# EAGLE design switch (EAGLE 4.16)
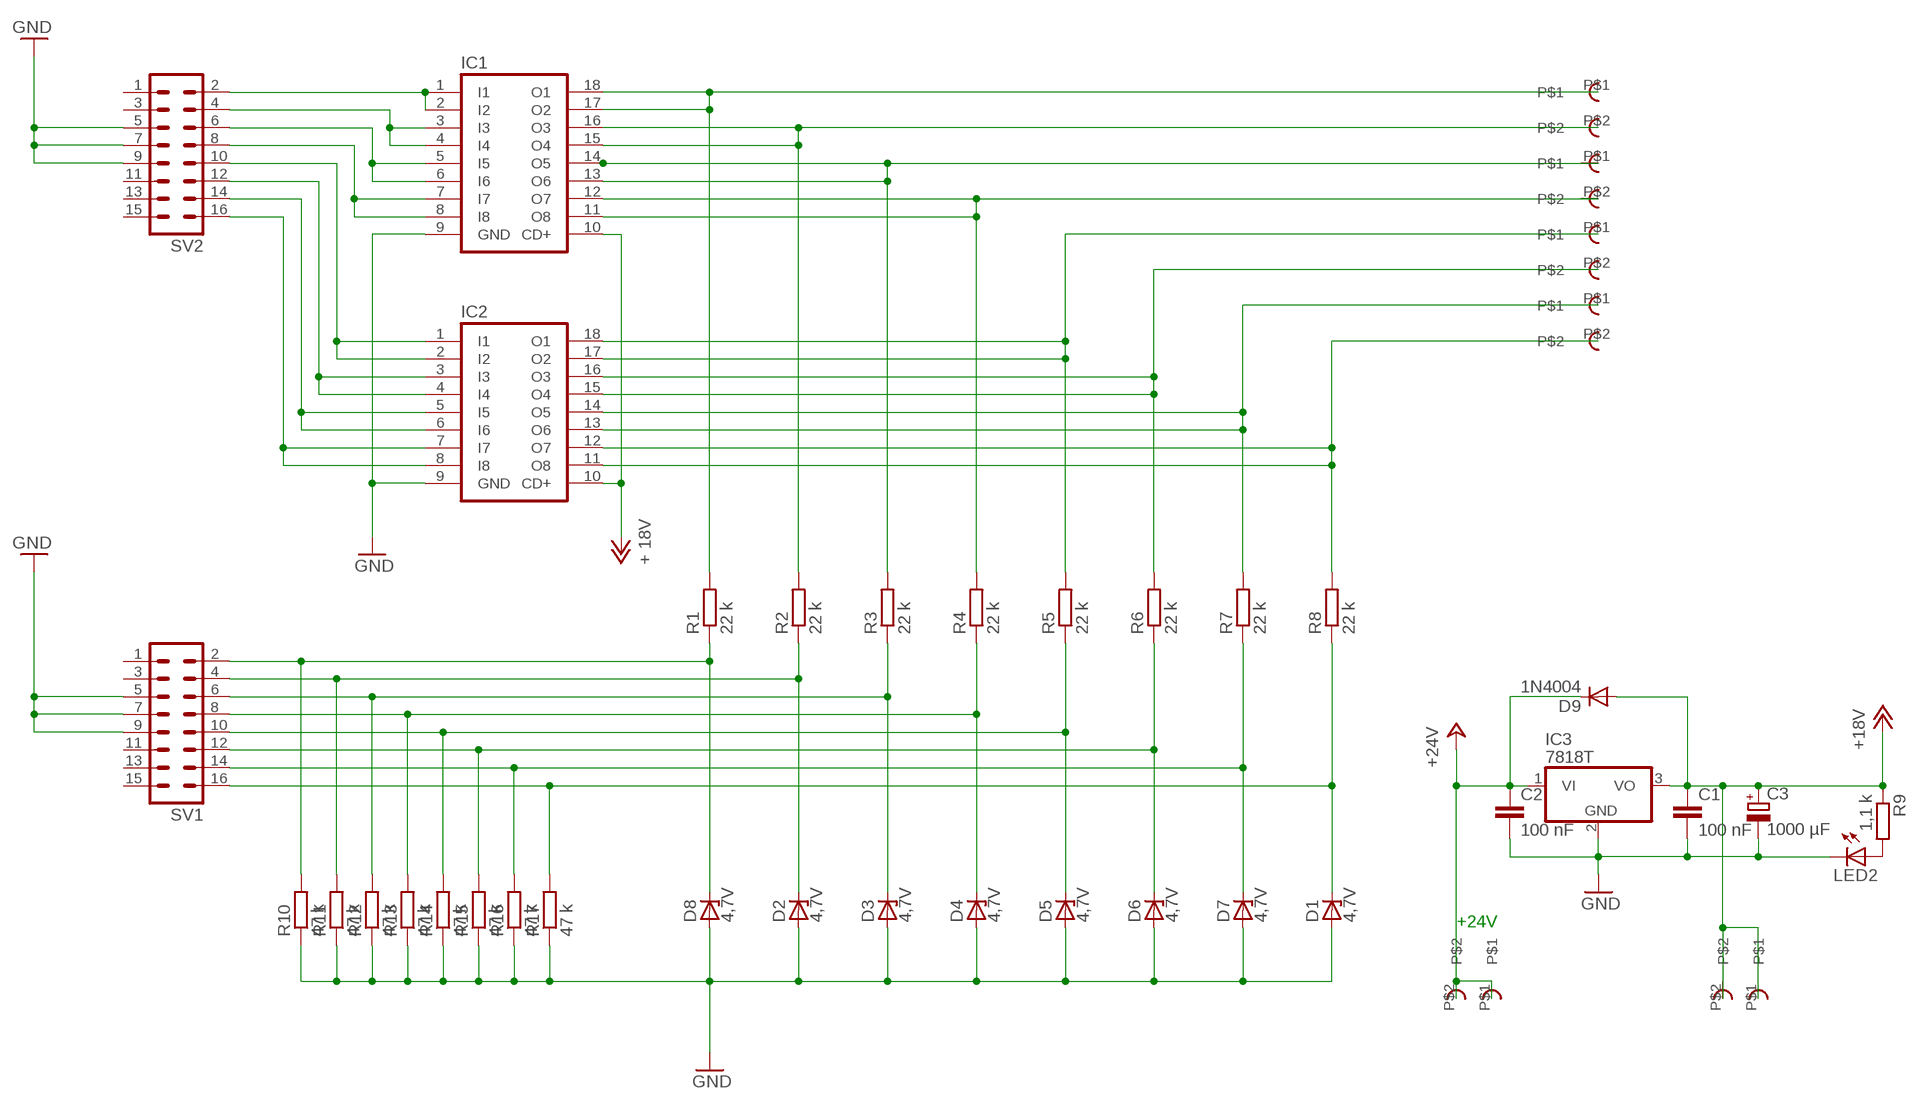
[diagram p0: schematic, sheet 1]

## Parts
+18V  RIACON101-2  [RIACON101-2]
+24V  RIACON101-2  [RIACON101-2]
C1  100 nF  C-EUC0603K  [C0603K]
C2  100 nF  C-EUC0603K  [C0603K]
C3  1000 µF  CPOL-EUE5-10.5  [E5-10,5]
D1  4,7V  ZENER-DIODESOD80C  [SOD80C]
D2  4,7V  ZENER-DIODESOD80C  [SOD80C]
D3  4,7V  ZENER-DIODESOD80C  [SOD80C]
D4  4,7V  ZENER-DIODESOD80C  [SOD80C]
D5  4,7V  ZENER-DIODESOD80C  [SOD80C]
D6  4,7V  ZENER-DIODESOD80C  [SOD80C]
D7  4,7V  ZENER-DIODESOD80C  [SOD80C]
D8  4,7V  ZENER-DIODESOD80C  [SOD80C]
D9  1N4004  [DO41-10]
IC1  ULN2803A  [DIL18]
IC2  ULN2803A  [DIL18]
IC3  7818T  [TO220H]
LED2  LEDCHIPLED_0603  [CHIPLED_0603]
R1  22 k  R-EU_R0603  [R0603]
R2  22 k  R-EU_R0603  [R0603]
R3  22 k  R-EU_R0603  [R0603]
R4  22 k  R-EU_R0603  [R0603]
R5  22 k  R-EU_R0603  [R0603]
R6  22 k  R-EU_R0603  [R0603]
R7  22 k  R-EU_R0603  [R0603]
R8  22 k  R-EU_R0603  [R0603]
R9  1,1 k  R-EU_R0603  [R0603]
R10  47 k  R-EU_R0603  [R0603]
R11  47 k  R-EU_R0603  [R0603]
R12  47 k  R-EU_R0603  [R0603]
R13  47 k  R-EU_R0603  [R0603]
R14  47 k  R-EU_R0603  [R0603]
R15  47 k  R-EU_R0603  [R0603]
R16  47 k  R-EU_R0603  [R0603]
R17  47 k  R-EU_R0603  [R0603]
SV1  ML16  [ML16]
SV2  ML16  [ML16]
U$1  RIACON101-2  [RIACON101-2]
U$2  RIACON101-2  [RIACON101-2]
U$3  RIACON101-2  [RIACON101-2]
U$4  RIACON101-2  [RIACON101-2]

## Nets
+18V: +18V.P$1 +18V.P$2 C1.1 C3.+ D9.A IC1.10(CD+) IC2.10(CD+) IC3.3(VO) R9.1 ; supply symbol labelled + 18V
+24V: +24V.P$1 +24V.P$2 C2.1 D9.C IC3.1(VI)
GND: C1.2 C2.2 C3.- D1.A D2.A D3.A D4.A D5.A D6.A D7.A D8.A IC1.9(GND) IC2.9(GND) IC3.2(GND) LED2.C R10.1 R11.1 R12.1 R13.1 R14.1 R15.1 R16.1 R17.1 SV1.5 SV1.7 SV1.9 SV2.5 SV2.7 SV2.9
N$1: IC1.1(I1) IC1.2(I2) SV2.2
N$2: IC1.3(I3) IC1.4(I4) SV2.4
N$3: IC1.5(I5) IC1.6(I6) SV2.6
N$4: IC1.7(I7) IC1.8(I8) SV2.8
N$5: IC2.1(I1) IC2.2(I2) SV2.10
N$6: IC1.13(O6) IC1.14(O5) R3.2 U$2.P$1
N$7: IC2.3(I3) IC2.4(I4) SV2.12
N$8: IC2.5(I5) IC2.6(I6) SV2.14
N$9: IC2.7(I7) IC2.8(I8) SV2.16
N$10: IC1.15(O4) IC1.16(O3) R2.2 U$1.P$2
N$11: IC1.11(O8) IC1.12(O7) R4.2 U$2.P$2
N$12: IC1.17(O2) IC1.18(O1) R1.2 U$1.P$1
N$13: IC2.17(O2) IC2.18(O1) R5.2 U$3.P$1
N$14: IC2.15(O4) IC2.16(O3) R6.2 U$3.P$2
N$15: IC2.13(O6) IC2.14(O5) R7.2 U$4.P$1
N$16: LED2.A R9.2
N$17: IC2.11(O8) IC2.12(O7) R8.2 U$4.P$2
N$18: D8.C R1.1 R10.2 SV1.2
N$19: D2.C R2.1 R11.2 SV1.4
N$20: D3.C R3.1 R12.2 SV1.6
N$21: D4.C R4.1 R13.2 SV1.8
N$22: D5.C R5.1 R14.2 SV1.10
N$23: D6.C R6.1 R15.2 SV1.12
N$24: D7.C R7.1 R16.2 SV1.14
N$25: D1.C R8.1 R17.2 SV1.16
Unconnected: SV1.1 SV1.3 SV1.11 SV1.13 SV1.15 SV2.1 SV2.3 SV2.11 SV2.13 SV2.15

## Notes on the sheet
- +24V

## Library data of the parts
+18V +24V U$1-U$4 = con-riacon101:RIACON101-2: Riaconn Schreaubklemme 101
C1 C2 = rcl:C-EU: CAPACITOR, European symbol
C3 = rcl:CPOL-EU: POLARIZED CAPACITOR, European symbol
D1-D8 = diode:ZENER-DIODE: Z-Diode
D9 = diode:1N4004: DIODE general purpose rectifier, 1 A
IC1 IC2 = uln-udn:ULN2803A: DRIVER ARRAY
IC3 = linear:78*: Positive VOLTAGE REGULATOR Source: http://cache.national.com/ds/LM/LM78L05.pdf http://www.fairchildsemi.com/ds/LM/LM7805.pdf
LED2 = led:LED: LED OSRAM: - CHIPLED LG R971, LG N971, LY N971, LG Q971, LY Q971, LO R971, LY R971 LH N974, LH R974 LS Q976, LO Q976, LY Q976 LO Q996 - Hyper CHIPLED LW Q18S LB Q993, LB Q99A, LB R99A - SideLED LS A670, LO A670, LY A670, LG A670, LP A670 LB A673, LV A673, LT A673, LW A673 LH A674 LY A675 LS A676, LA A676, LO A676, LY A676, LW A676 LS A679, LY A679, LG A679 - Hyper Micro SIDELED® LS Y876, LA Y876, LO Y876, LY Y876 LT Y87S - SmartLED LW L88C, LW L88S LB L89C, LB L89S, LG L890 LS L89K, LO L89K, LY L89K LS L896, LA L896, LO L896, LY L896 - TOPLED LS T670, LO T670, LY T670, LG T670, LP T670 LSG T670, LSP T670, LSY T670, LOP T670, LYG T670 LG T671, LOG T671, LSG T671 LB T673, LV T673, LT T673, LW T673 LH T674 LS T676, LA T676, LO T676, LY T676, LB T676, LH T676, LSB T676, LW T676 LB T67C, LV T67C, LT T67C, LS T67K, LO T67K, LY T67K, LW E67C LS E67B, LA E67B, LO E67B, LY E67B, LB E67C, LV E67C, LT E67C LW T67C LS T679, LY T679, LG T679 LS T770, LO T770, LY T770, LG T770, LP T770 LB T773, LV T773, LT T773, LW T773 LH T774 LS E675, LA E675, LY E675, LS T675 LS T776, LA T776, LO T776, LY T776, LB T776 LHGB T686 LT T68C, LB T68C - Hyper Mini TOPLED® LB M676 - Mini TOPLED Santana® LG M470 LS M47K, LO M47K, LY M47K Source: http://www.osram.convergy.de - LUMILED® LXK2-PW12-R00, LXK2-PW12-S00, LXK2-PW14-U00, LXK2-PW14-V00 LXK2-PM12-R00, LXK2-PM12-S00, LXK2-PM14-U00 LXK2-PE12-Q00, LXK2-PE12-R00, LXK2-PE12-S00, LXK2-PE14-T00, LXK2-PE14-U00 LXK2-PB12-K00, LXK2-PB12-L00, LXK2-PB12-M00, LXK2-PB14-N00, LXK2-PB14-P00, LXK2-PB14-Q00 LXK2-PR12-L00, LXK2-PR12-M00, LXK2-PR14-Q00, LXK2-PR14-R00 LXK2-PD12-Q00, LXK2-PD12-R00, LXK2-PD12-S00 LXK2-PH12-R00, LXK2-PH12-S00 LXK2-PL12-P00, LXK2-PL12-Q00, LXK2-PL12-R00 Source: www.luxeon.com
R1-R17 = rcl:R-EU_: RESISTOR, European symbol
SV1 SV2 = con-harting-ml:ML16: HARTING

## Board
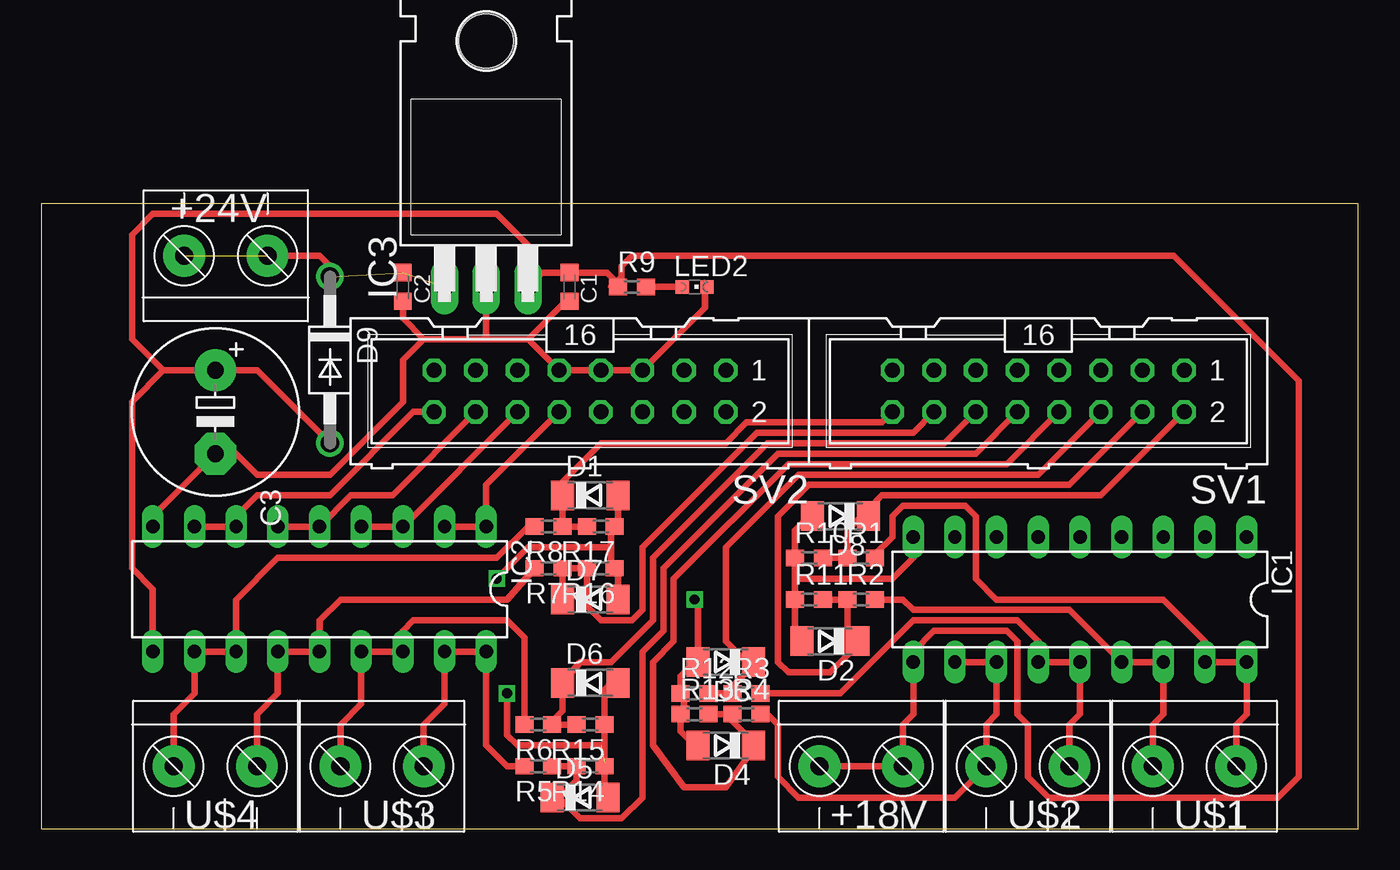
[diagram p1: board, top side]
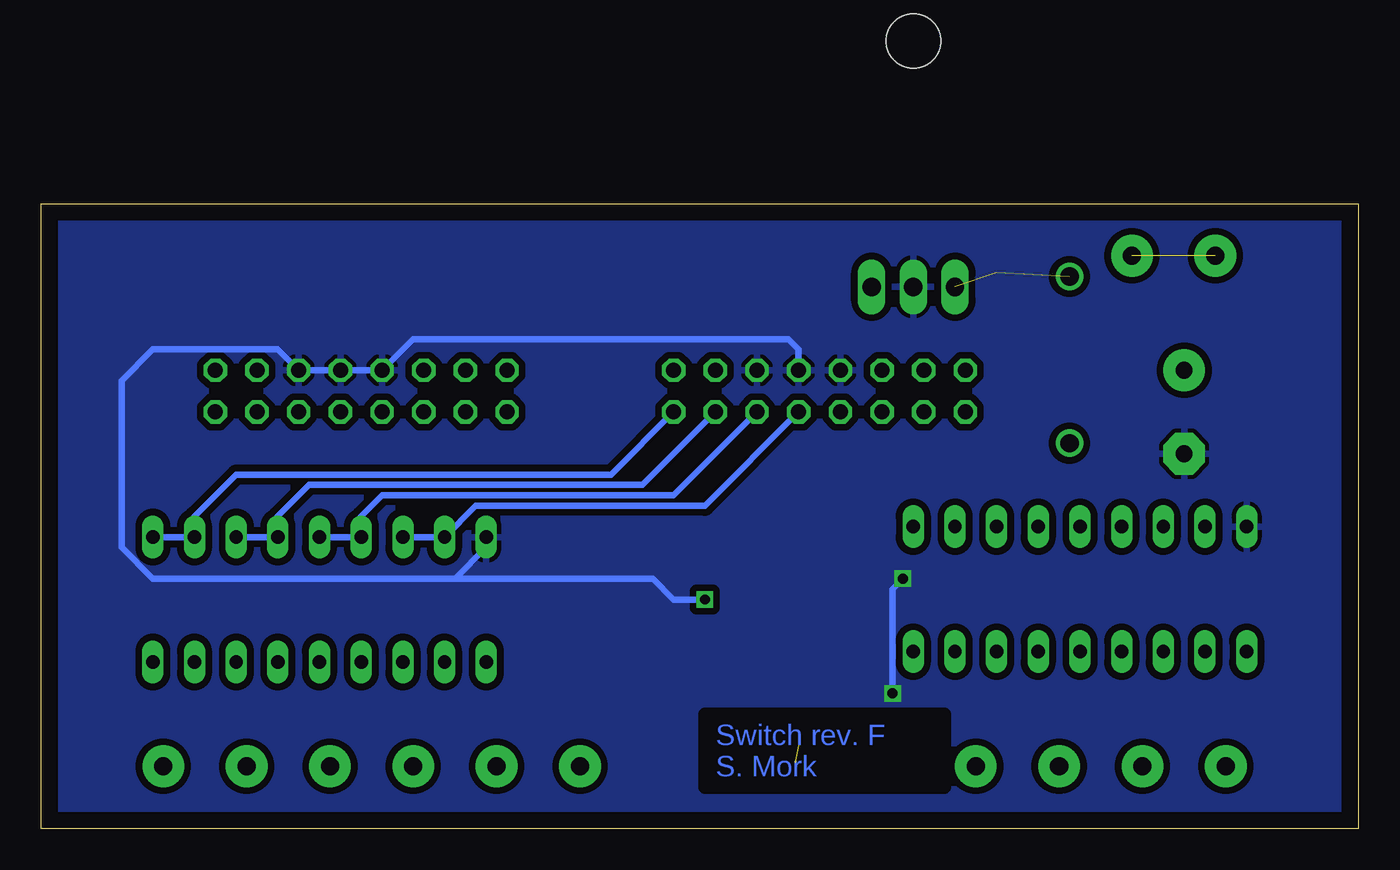
[diagram p2: board, bottom side, seen from below]

Size 80.31 x 38.09 mm. Coordinates in mm from the lower left corner, seen from the top.
Outline: 0,0 80.31,0 80.31,38.09 0,38.09 0,0
Copper layers (1*16): Top 0.035mm / dielectric 1.5mm / Bottom 0.035mm
Design rules "default": minimum track width 10mil, minimum drill 24mil, track to track 8mil, track to pad 8mil, pad to pad 8mil, via to via 8mil, smd to smd 8mil, copper to edge 40mil, drill to drill 8mil, minimum pad ring 10mil, minimum via ring 8mil, stop-mask expansion 4mil, vias tented up to drill 0mil, thermal gap 10mil
tRestrict: area 75.4,0 to 80.5,38.1; area -0.2,0 to 4.9,38.1
bRestrict: area 25.2,2.5 to 39.8,7

### Footprints (pad centres in the part's own frame; a part is rotated, then mirrored left to right if it is on the bottom)
RIACON101-2 = drill 1.1 pad 2.54 round: P$1 0,2.54; P$2 0,-2.54
C0603K = smd 1.05 x 1.08: 1 -0.875,0; 2 0.875,0
E5-10,5 = drill 1.016 pad 2.54 round: + -2.54,0 | drill 1.016 pad 2.54 octagon: - 2.54,0
SOD80C = smd 1.4 x 1.8: A 1.7,0; C -1.7,0
DO41-10 = drill 1.118 round: A 5.08,0; C -5.08,0
DIL18 = drill 0.813 long: 1 -10.16,-3.81; 2 -7.62,-3.81; 3 -5.08,-3.81; 4 -2.54,-3.81; 5 0,-3.81; 6 2.54,-3.81; 7 5.08,-3.81; 8 7.62,-3.81; 9 10.16,-3.81; 10 10.16,3.81; 11 7.62,3.81; 12 5.08,3.81; 13 2.54,3.81; 14 0,3.81; 15 -2.54,3.81; 16 -5.08,3.81; 17 -7.62,3.81; 18 -10.16,3.81
TO220H = drill 1.118 long: 1 -2.54,-10.16; 2 0,-10.16; 3 2.54,-10.16 | hole 3.302: 0,4.826
CHIPLED_0603 = smd 0.8 x 0.8: A 0,-0.75; C 0,0.75
R0603 = smd 1.1 x 1: 1 -0.85,0; 2 0.85,0
ML16 = drill 0.914 octagon: 1 -8.89,-1.27; 2 -8.89,1.27; 3 -6.35,-1.27; 4 -6.35,1.27; 5 -3.81,-1.27; 6 -3.81,1.27; 7 -1.27,-1.27; 8 -1.27,1.27; 9 1.27,-1.27; 10 1.27,1.27; 11 3.81,-1.27; 12 3.81,1.27; 13 6.35,-1.27; 14 6.35,1.27; 15 8.89,-1.27; 16 8.89,1.27

### Placement (x,y rotation side)
+18V  50,3.8 270 top
+24V  11.27,34.92 90 top
C1  32.22,33.02 270 top
C2  22.06,33.02 270 top
C3  10.63,25.39 270 top
D1  33.49,20.32 0 top
D2  48.09,11.43 180 top
D3  41.74,10.16 180 top
D4  41.74,5.08 180 top
D5  32.85,1.9 0 top
D6  33.49,8.88 0 top
D7  33.49,13.96 0 top
D8  48.73,19.05 180 top
D9  17.61,28.57 270 top
IC1  63.34,13.96 180 top
IC2  16.98,14.6 180 top
IC3  27.14,43.17 0 top
LED2  39.84,33.02 270 top
R1  50,16.5 0 top
R2  50,13.96 0 top
R3  43.02,8.25 0 top
R4  43.02,6.98 0 top
R5  30.31,3.8 180 top
R6  30.31,6.34 180 top
R7  30.95,15.87 180 top
R8  30.95,18.41 180 top
R9  36.03,33.02 0 top
R10  46.82,16.5 0 top
R11  46.82,13.96 0 top
R12  39.84,8.25 0 top
R13  39.84,6.98 0 top
R14  33.49,3.8 180 top
R15  33.49,6.34 180 top
R16  34.12,15.87 180 top
R17  34.12,18.41 180 top
SV1  60.8,26.66 180 top
SV2  32.85,26.66 180 top
U$1  70.32,3.8 270 top
U$2  60.16,3.8 270 top
U$3  20.79,3.8 270 top
U$4  10.63,3.8 270 top

### Tracks (layer width: path | path; a pad name or v marks a point on that pad's centre or on a via)
+18V
  Top 0.406: +18V.P$2 +18V.P$1 52.54,6.34 53.17,6.98 IC1.10 53.17,10.79 54.45,12.06 58.89,12.06 59.52,11.43 59.52,6.98 60.16,6.34 60.16,3.17 61.43,1.9 75.4,1.9 76.67,3.17 76.67,27.3 69.05,34.92 36.03,34.92 35.39,34.29 35.39,33.65 34.76,33.02 R9.1 35.39,33.02 34.52,33.89 C1.1 30.55,33.89 IC3.3 29.68,35.55 27.77,37.46 6.82,37.46 5.55,36.19 5.55,29.84 7.46,27.94 | 7.46,27.94 C3.+ 13.17,27.94 D9.A | IC2.10 6.82,14.6 5.55,15.87 5.55,26.03 7.46,27.94
+24V  (3 unrouted)
  Top 0.406: D9.C 17.61,34.29 16.98,34.92 +24V.P$2
GND  (via drill 0.6)  (1 unrouted)
  Top 0.406: D7.A 35.19,15.44 34.76,15.87 | 34.76,18.41 R17.1 | D1.A 35.19,18.84 34.76,18.41 | 34.76,15.87 R16.1 | 34.76,17.14 34.76,15.87 | 34.76,17.14 34.76,18.41 | 35.19,9.32 D6.A 34.76,8.88 34.34,8.46 R15.1 34.34,4.02 34.12,3.8 R14.1 34.34,2.32 34.76,1.9 D5.A | D4.A 39.84,5.08 38.99,5.92 R13.1 39.2,6.98 39.2,8.25 R12.1 38.99,9.3 39.84,10.16 D3.A 40.05,13.76 v39.84,13.96 | IC2.9 6.82,19.05 C3.- 11.9,22.86 13.17,21.59 17.61,21.59 22.06,26.03 22.06,28.57 23.33,29.84 | D2.A 46.19,11.43 45.98,11.64 R11.1 46.19,13.96 45.98,14.18 45.98,15.24 | D8.A 46.82,19.05 45.98,18.2 R10.1 45.98,15.24 | IC1.9 53.17,16.5 51.91,15.24 45.98,15.24 | 34.76,17.14 29.68,17.14 v27.77,15.24 | 34.12,5.08 29.04,5.08 28.41,5.71 v28.41,8.25 | 29.68,29.84 SV2.9 SV2.7 SV2.5 40.48,31.75 40.48,33.02 LED2.C | 27.14,29.84 29.68,29.84 | C2.2 22.06,31.11 23.33,29.84 | 23.33,29.84 27.14,29.84 | 27.14,29.84 IC3.2 | C1.2 31.98,32.14 29.68,29.84
  Bottom 0.406: IC1.9 53.17,17.14 55.08,15.24 | 55.08,15.24 73.5,15.24 75.4,17.14 75.4,27.3 73.5,29.21 65.88,29.21 SV1.5 SV1.7 SV1.9 57.62,29.84 34.76,29.84 34.12,29.21 SV2.7 | v39.84,13.96 41.74,13.96 43.02,15.24 55.08,15.24 | v28.41,8.25 28.41,14.6 v27.77,15.24
  pour Bottom (isolate 0.406): -0.17,38.09 80.48,38.09 80.48,-0.01 -0.17,-0.01
N$1
  Bottom 0.406: SV2.2 45.55,21.59 68.41,21.59 70.95,19.05 IC1.2 | IC1.2 IC1.1 | IC1.2 IC1.1 | IC1.1 IC1.2
N$2
  Bottom 0.406: SV2.4 43.65,20.95 63.97,20.95 65.88,19.05 IC1.4 IC1.3
N$3
  Bottom 0.406: SV2.6 41.74,20.32 59.52,20.32 60.8,19.05 IC1.6 IC1.5
N$4
  Bottom 0.406: SV2.8 39.84,19.68 53.81,19.68 IC1.8 | IC1.8 IC1.7 IC1.8
N$5
  Top 0.406: IC2.1 IC2.2 IC2.1 | IC2.1 27.14,20.95 SV2.10
N$6
  Top 0.406: U$2.P$1 62.7,6.34 63.34,6.98 IC1.14 IC1.13 60.8,11.43 59.52,12.7 53.17,12.7 48.73,8.25 R3.2
N$7
  Top 0.406: IC2.3 IC2.4 IC2.3 | IC2.3 SV2.12
N$8
  Top 0.406: IC2.5 IC2.6 IC2.5 | IC2.5 18.88,20.32 21.42,20.32 SV2.14
N$9
  Top 0.406: IC2.8 IC2.7 11.9,19.05 13.17,20.32 17.61,20.32 22.7,25.39 SV2.16
N$10
  Top 0.406: U$1.P$2 67.78,6.34 68.41,6.98 IC1.16 IC1.15 62.7,13.33 53.17,13.33 52.54,13.96 R2.2
N$11
  Top 0.406: IC1.11 IC1.12 58.25,6.98 57.62,6.34 U$2.P$2 55.71,1.9 46.19,1.9 44.92,3.17 44.92,6.34 44.28,6.98 R4.2
N$12
  Top 0.406: U$1.P$1 72.86,6.34 73.5,6.98 IC1.18 IC1.17 70.95,11.43 68.41,13.96 58.25,13.96 56.98,15.24 56.98,19.05 56.35,19.68 52.54,19.68 51.91,19.05 51.91,17.78 50.85,16.72 R1.2
N$13
  Top 0.406: U$3.P$1 23.33,6.34 24.6,7.61 IC2.17 IC2.18 27.14,5.08 28.41,3.8 R5.2
N$14
  Top 0.406: U$3.P$2 18.25,6.34 19.52,7.61 IC2.15 IC2.16 22.06,12.06 22.7,12.7 28.41,12.7 29.46,11.64 R6.2
N$15
  Top 0.406: U$4.P$1 13.17,6.98 14.44,8.25 IC2.13 IC2.14 16.98,12.7 18.25,13.96 28.41,13.96 R7.2
N$16
  Top 0.406: 39.2,33.02 LED2.A R9.2
N$17
  Top 0.406: U$4.P$2 8.09,6.98 9.36,8.25 IC2.11 IC2.12 11.9,13.96 14.44,16.5 27.77,16.5 29.68,18.41 R8.2
N$18
  Top 0.406: R10.2 R1.1 49.15,18.2 50,19.05 D8.C 50.43,19.48 51.27,20.32 64.61,20.32 SV1.2
N$19
  Top 0.406: R2.1 R11.2 | D2.C 49.37,11.43 49.15,11.64 R2.1 | R2.1 49.15,10.58 48.09,9.52 45.55,9.52 44.92,10.16 44.92,19.05 46.82,20.95 62.7,20.95 SV1.4
N$20
  Top 0.406: R3.1 42.38,8.25 | R12.2 R3.1 | D3.C 43.65,10.16 42.16,8.67 R3.1 | D3.C 43.45,10.36 | SV1.6 60.8,21.59 46.19,21.59 41.74,17.14 41.74,11.43 43.02,10.16 D3.C
N$21
  Top 0.406: R4.1 42.38,6.98 | R4.1 R13.2 | R4.1 42.16,6.56 43.65,5.08 D4.C 43.45,4.87 41.74,2.54 39.2,2.54 37.3,5.08 37.3,10.16 38.57,11.43 38.57,15.24 45.55,22.22 58.89,22.22 SV1.8
N$22
  Top 0.406: SV1.10 56.98,22.86 44.92,22.86 37.94,15.87 37.94,12.06 36.66,10.79 36.66,1.9 35.39,0.63 32.85,0.63 31.58,1.9 | R14.2 32.85,3.8 | R14.2 R5.1 | D5.C 31.58,1.9 | R14.2 32.64,2.96 31.58,1.9
N$23
  Top 0.406: R15.2 R6.1 30.95,6.34 31.79,7.18 D6.C 32.85,10.16 34.76,10.16 37.3,12.7 37.3,16.5 44.28,23.49 55.08,23.49 SV1.12
N$24
  Top 0.406: R16.2 32.85,15.87 | R16.2 R7.1 31.8,14.38 31.58,13.96 D7.C | R16.2 33.27,13.54 34.12,12.7 36.03,12.7 36.66,13.33 36.66,17.14 43.65,24.12 53.17,24.12 SV1.14
N$25
  Top 0.406: R17.2 R8.1 | R8.1 31.8,18.62 | SV1.16 51.27,24.76 43.02,24.76 41.74,23.49 34.12,23.49 31.79,21.16 D1.C 31.79,18.62 31.58,18.41 R8.1
N$27  (via drill 0.6)
  other vias: 39.84,13.96

### Text on the board
Bottom: Switch rev. F | S. Mork